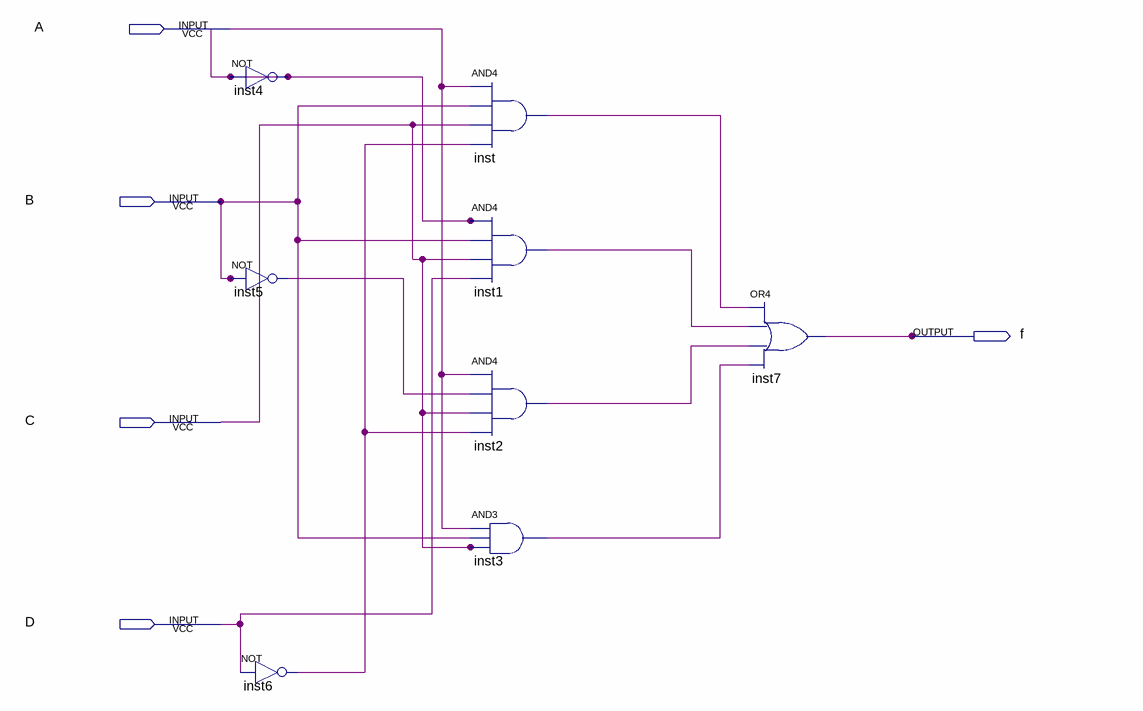
[diagram p0: schematic sheet]
// Quartus schematic Lab3Q2.bdf as structural Verilog: 8 symbols, 5 pins
module Lab3Q2 (
  input  A,
  input  B,
  input  C,
  input  D,
  output f
);

  wire inst1_out, inst2_out, inst3_out, inst4_out, inst5_out, inst6_out, inst_out;

  not inst4 (inst4_out, inst4_out);
  not inst5 (inst5_out, B);
  not inst6 (inst6_out, D);
  and inst (inst_out, A, B, C, inst6_out);
  and inst1 (inst1_out, inst4_out, B, C, D);
  and inst2 (inst2_out, A, inst5_out, C, inst6_out);
  and inst3 (inst3_out, A, B, C);
  or inst7 (f, inst_out, inst1_out, inst2_out, inst3_out);
endmodule
